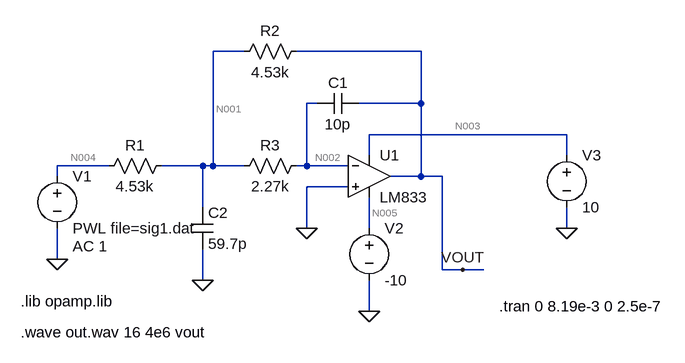
[diagram p0: schematic LPF.asc]
LPF.asc, the LTspice schematic file:
Version 4
SHEET 1 968 680
WIRE 288 -320 240 -320
WIRE 560 -320 368 -320
WIRE 400 -240 384 -240
WIRE 560 -240 560 -320
WIRE 560 -240 464 -240
WIRE 784 -192 480 -192
WIRE 480 -160 480 -192
WIRE 784 -160 784 -192
WIRE 80 -144 0 -144
WIRE 224 -144 160 -144
WIRE 240 -144 240 -320
WIRE 240 -144 224 -144
WIRE 288 -144 240 -144
WIRE 384 -144 384 -240
WIRE 384 -144 368 -144
WIRE 448 -144 384 -144
WIRE 0 -128 0 -144
WIRE 560 -128 560 -240
WIRE 560 -128 512 -128
WIRE 592 -128 560 -128
WIRE 448 -112 384 -112
WIRE 224 -80 224 -144
WIRE 384 -48 384 -112
WIRE 480 -48 480 -96
WIRE 784 -48 784 -80
WIRE 0 0 0 -48
WIRE 592 16 592 -128
WIRE 624 16 592 16
WIRE 656 16 624 16
WIRE 224 32 224 -16
WIRE 480 80 480 32
FLAG 224 32 0
FLAG 384 -48 0
FLAG 480 80 0
FLAG 784 -48 0
FLAG 0 0 0
FLAG 624 16 VOUT
SYMBOL res 176 -160 R90
WINDOW 0 0 56 VBottom 2
WINDOW 3 32 56 VTop 2
SYMATTR InstName R1
SYMATTR Value 4.53k
SYMBOL res 384 -336 R90
WINDOW 0 0 56 VBottom 2
WINDOW 3 32 56 VTop 2
SYMATTR InstName R2
SYMATTR Value 4.53k
SYMBOL res 384 -160 R90
WINDOW 0 0 56 VBottom 2
WINDOW 3 32 56 VTop 2
SYMATTR InstName R3
SYMATTR Value 2.27k
SYMBOL cap 464 -256 R90
WINDOW 0 0 32 VBottom 2
WINDOW 3 32 32 VTop 2
SYMATTR InstName C1
SYMATTR Value 10p
SYMBOL cap 208 -80 R0
SYMATTR InstName C2
SYMATTR Value 59.7p
SYMBOL voltage 0 -144 R0
WINDOW 123 24 124 Left 2
WINDOW 39 0 0 Left 2
SYMATTR Value2 AC 1
SYMATTR InstName V1
SYMATTR Value PWL file=sig1.dat
SYMBOL voltage 480 -64 R0
WINDOW 123 0 0 Left 2
WINDOW 39 0 0 Left 2
SYMATTR InstName V2
SYMATTR Value -10
SYMBOL voltage 784 -176 R0
WINDOW 123 0 0 Left 2
WINDOW 39 0 0 Left 2
SYMATTR InstName V3
SYMATTR Value 10
SYMBOL Opamps\\opamp2 480 -192 R0
SYMATTR InstName U1
SYMATTR Value LM833
TEXT -56 64 Left 2 !.lib opamp.lib
TEXT 680 72 Left 2 !.tran 0 8.19e-3 0 2.5e-7
TEXT -56 112 Left 2 !.wave out.wav 16 4e6 vout

The netlist it stands for:
* LPF.asc
R1 N001 N004 4.53k
R2 VOUT N001 4.53k
R3 N002 N001 2.27k
C1 VOUT N002 10p
C2 N001 0 59.7p
V1 N004 0 PWL file=sig1.dat AC 1
V2 N005 0 -10
V3 N003 0 10
XU1 0 N002 N003 N005 VOUT LM833  ; pins In+ In- V+ V- OUT
.lib opamp.lib
.tran 0 8.19e-3 0 2.5e-7
.wave out.wav 16 4e6 vout
.backanno
.end

* Results of the author's LTspice run, read from the files saved beside the schematic
* Operating Point, zero values left out:
*   V(n001) = 804.5 µV
*   V(n004) = -7.039 mV
*   V(vout) = 9.954 mV
*   V(n002) = 149.9 µV
*   V(n005) = -10 V
*   V(n003) = 10 V
*   I(R3) = -288.4 nA
*   I(R2) = 2.02 µA
*   I(R1) = 1.731 µA
*   I(V3) = -2.052 mA
*   I(V2) = 2.05 mA
*   I(V1) = 1.731 µA
*   Ix(u1:IN+) = 311.6 nA
*   Ix(u1:IN-) = 288.4 nA
*   Ix(u1:VCC+) = 2.052 mA
*   Ix(u1:VCC-) = -2.05 mA
*   Ix(u1:OUT) = -2.02 µA